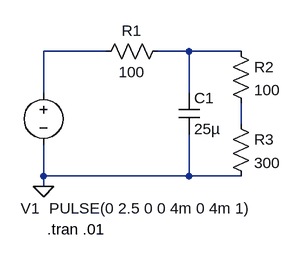
[diagram p0: schematic assignment7.asc]
assignment7.asc, the LTspice schematic file:
Version 4
SHEET 1 880 680
WIRE 192 80 96 80
WIRE 320 80 272 80
WIRE 400 80 320 80
WIRE 96 144 96 80
WIRE 320 144 320 80
WIRE 400 192 400 160
WIRE 96 272 96 224
WIRE 320 272 320 208
WIRE 320 272 96 272
WIRE 400 272 320 272
WIRE 96 288 96 272
FLAG 96 288 0
SYMBOL voltage 96 128 R0
WINDOW 0 -35 194 Left 2
WINDOW 3 9 194 Left 2
WINDOW 123 0 0 Left 0
WINDOW 39 0 0 Left 0
SYMATTR InstName V1
SYMATTR Value PULSE(0 2.5 0 0 4m 0 4m 1)
SYMBOL res 288 64 R90
WINDOW 0 0 56 VBottom 2
WINDOW 3 32 56 VTop 2
SYMATTR InstName R1
SYMATTR Value 100
SYMBOL res 384 64 R0
SYMATTR InstName R2
SYMATTR Value 100
SYMBOL res 384 176 R0
SYMATTR InstName R3
SYMATTR Value 300
SYMBOL cap 304 144 R0
SYMATTR InstName C1
SYMATTR Value 25µ
TEXT 102 354 Left 2 !.tran .01

The netlist it stands for:
* assignment7.asc
V1 N001 0 PULSE(0 2.5 0 0 4m 0 4m 1)
R1 N002 N001 100
R2 N002 N003 100
R3 N003 0 300
C1 N002 0 25µ
.tran .01
.backanno
.end